# Altium schematic sheet TU_MAIN.SchDoc
size 1651 x 1651 mm
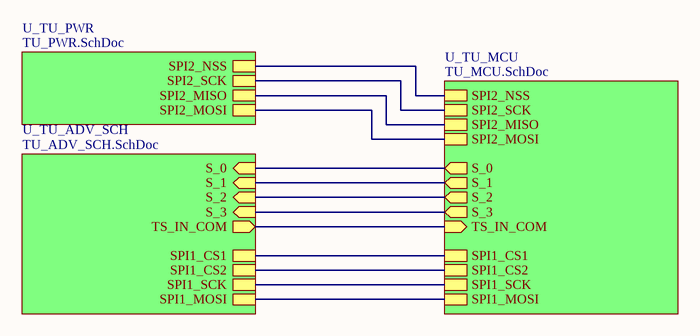
[diagram p0: TU_MAIN.SchDoc]

## Sub-sheets
U_TU_ADV_SCH = TU_ADV_SCH.SchDoc: TS_IN_COM (out), SPI1_CS1, SPI1_CS2, SPI1_MOSI, SPI1_SCK, S_0 (in), S_1 (in), S_2 (in), S_3 (in)
U_TU_MCU = TU_MCU.SchDoc: SPI2_NSS, SPI2_SCK, SPI2_MISO, SPI2_MOSI, S_0 (out), S_1 (out), S_2 (out), S_3 (out), TS_IN_COM (in), SPI1_CS2, SPI1_SCK, SPI1_MOSI, SPI1_CS1
U_TU_PWR = TU_PWR.SchDoc: SPI2_NSS, SPI2_MOSI, SPI2_MISO, SPI2_SCK

## Nets
(unnamed): sheet U_TU_PWR/SPI2_NSS, sheet U_TU_MCU/SPI2_NSS
(unnamed): sheet U_TU_PWR/SPI2_MOSI, sheet U_TU_MCU/SPI2_MOSI
(unnamed): sheet U_TU_PWR/SPI2_MISO, sheet U_TU_MCU/SPI2_MISO
(unnamed): sheet U_TU_PWR/SPI2_SCK, sheet U_TU_MCU/SPI2_SCK
(unnamed): sheet U_TU_MCU/S_0, sheet U_TU_ADV_SCH/S_0
(unnamed): sheet U_TU_MCU/S_1, sheet U_TU_ADV_SCH/S_1
(unnamed): sheet U_TU_MCU/S_2, sheet U_TU_ADV_SCH/S_2
(unnamed): sheet U_TU_MCU/S_3, sheet U_TU_ADV_SCH/S_3
(unnamed): sheet U_TU_MCU/TS_IN_COM, sheet U_TU_ADV_SCH/TS_IN_COM
(unnamed): sheet U_TU_MCU/SPI1_CS2, sheet U_TU_ADV_SCH/SPI1_CS2
(unnamed): sheet U_TU_MCU/SPI1_SCK, sheet U_TU_ADV_SCH/SPI1_SCK
(unnamed): sheet U_TU_MCU/SPI1_MOSI, sheet U_TU_ADV_SCH/SPI1_MOSI
(unnamed): sheet U_TU_MCU/SPI1_CS1, sheet U_TU_ADV_SCH/SPI1_CS1